# EAGLE design multipointMv2 (EAGLE 6.2)
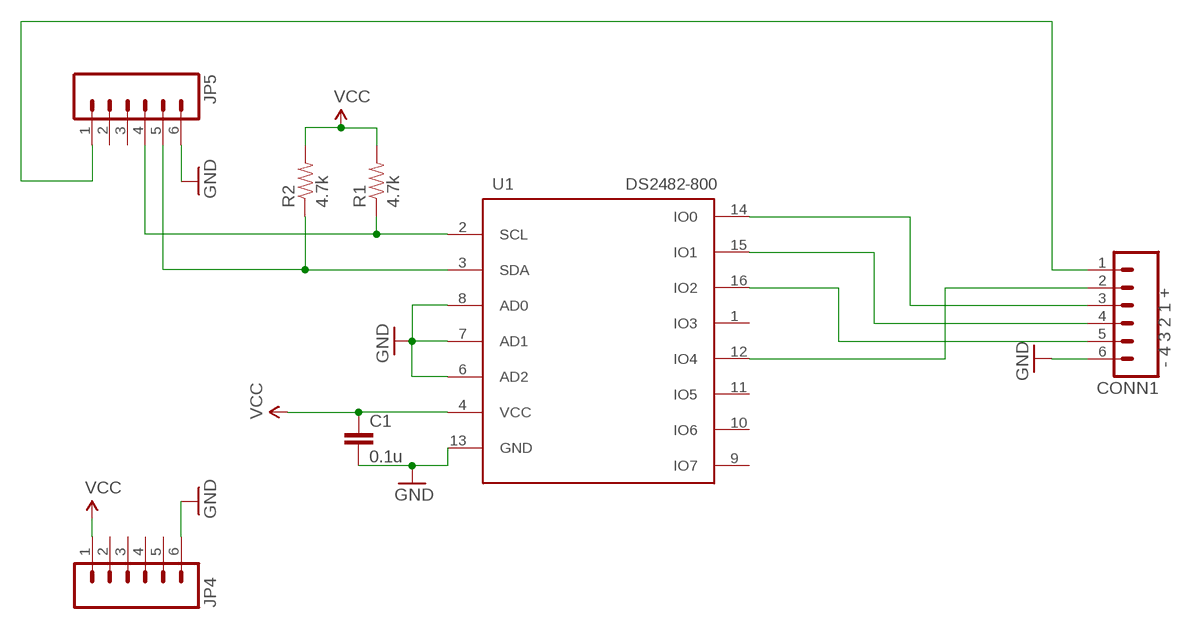
[diagram p0: schematic, sheet 1]

## Parts
C1  0.1u  CAP0805  [0805]
CONN1  - 4 3 2 1 +  M06LOCK_LONGPADS  [1X06_LOCK_LONGPADS]
JP4  M06LOCK_LONGPADS  [1X06_LOCK_LONGPADS]
JP5  M06LOCK_LONGPADS  [1X06_LOCK_LONGPADS]
R1  4.7k  RESISTOR0805-RES  [0805]
R2  4.7k  RESISTOR0805-RES  [0805]
U1  DS2482-800  [SO16]

## Nets
GND: C1.2 CONN1.6 JP4.6 JP5.6 U1.6(AD2) U1.7(AD1) U1.8(AD0) U1.13(GND)
N$1: CONN1.5 U1.16(IO2)
N$2: CONN1.4 U1.15(IO1)
N$3: CONN1.3 U1.14(IO0)
N$4: CONN1.2 U1.12(IO4)
N$7: CONN1.1 JP5.1
SCL: JP5.4 R1.1 U1.2(SCL)
SDA: JP5.5 R2.1 U1.3(SDA)
VCC: C1.1 JP4.1 R1.2 R2.2 U1.4(VCC)
Unconnected: JP4.2 JP4.3 JP4.4 JP4.5 JP5.2 JP5.3 U1.1(IO3) U1.9(IO7) U1.10(IO6) U1.11(IO5)

## Library data of the parts
C1 = SparkFun-Passives:CAP: Capacitor Standard 0603 ceramic capacitor, and 0.1" leaded capacitor.
CONN1 = SparkFun-Connectors:M06: Header 6 Standard 6-pin 0.1" header. Use with straight break away headers (SKU : PRT-00116), right angle break away headers (PRT-00553), swiss pins (PRT-00743), machine pins (PRT-00117), and female headers (PRT-00115). Molex polarized connector foot print use with SKU : PRT-08094 with associated crimp pins and housings. NOTES ON THE VARIANTS LOCK and LOCK_LONGPADS... This footprint was designed to help hold the alignment of a through-hole component (i.e. 6-pin header) while soldering it into place. You may notice that each hole has been shifted either up or down by 0.005 of an inch from it's more standard position (which is a perfectly straight line). This slight alteration caused the pins (the squares in the middle) to touch the edges of the holes. Because they are alternating, it causes a "brace" to hold the component in place. 0.005 has proven to be the perfect amount of "off-center" position when using our standard breakaway headers. Although looks a little odd when you look at the bare footprint, once you have a header in there, the alteration is very hard to notice. Also, if you push a header all the way into place, it is covered up entirely on the bottom side. This idea of altering the position of holes to aid alignment will be further integrated into the Sparkfun Library for other footprints. It can help hold any component with 3 or more connection pins.
JP4 JP5 = SparkFun:M06: Header 6 Standard 6-pin 0.1" header. Use with straight break away headers (SKU : PRT-00116), right angle break away headers (PRT-00553), swiss pins (PRT-00743), machine pins (PRT-00117), and female headers (PRT-00115). Molex polarized connector foot print use with SKU : PRT-08094 with associated crimp pins and housings. NOTES ON THE VARIANTS LOCK and LOCK_LONGPADS... This footprint was designed to help hold the alignment of a through-hole component (i.e. 6-pin header) while soldering it into place. You may notice that each hole has been shifted either up or down by 0.005 of an inch from it's more standard position (which is a perfectly straight line). This slight alteration caused the pins (the squares in the middle) to touch the edges of the holes. Because they are alternating, it causes a "brace" to hold the component in place. 0.005 has proven to be the perfect amount of "off-center" position when using our standard breakaway headers. Although looks a little odd when you look at the bare footprint, once you have a header in there, the alteration is very hard to notice. Also, if you push a header all the way into place, it is covered up entirely on the bottom side. This idea of altering the position of holes to aid alignment will be further integrated into the Sparkfun Library for other footprints. It can help hold any component with 3 or more connection pins.
R1 R2 = SparkFun-Passives:RESISTOR: Resistor Basic schematic elements and footprints for 0603, 1206, and PTH resistors.
U1 = exoteric-analytics-custom:DS2482-800

## Board
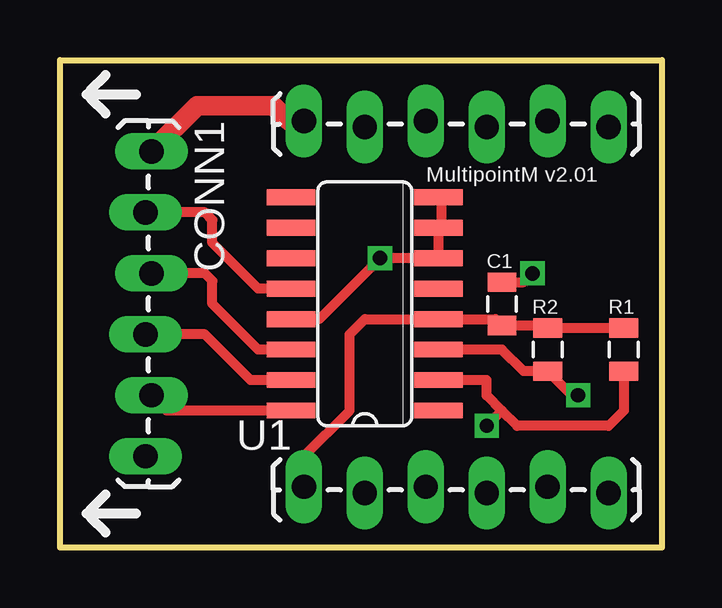
[diagram p1: board, top side]
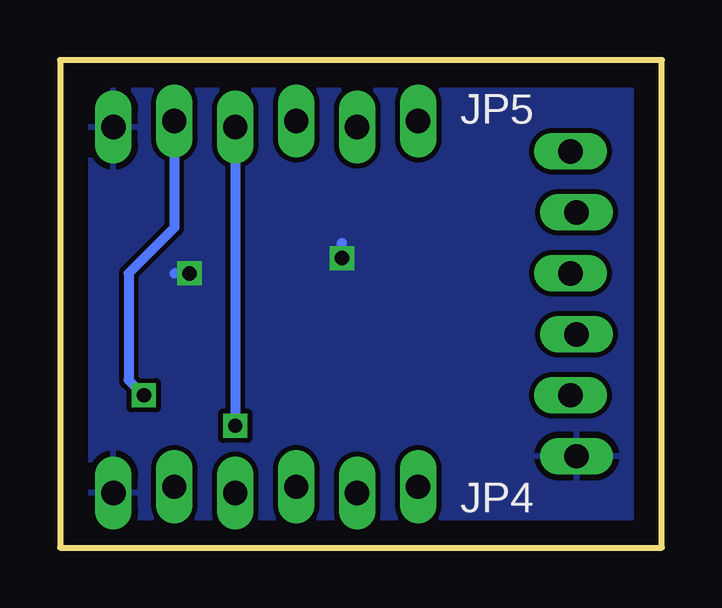
[diagram p2: board, bottom side, seen from below]

Size 25.08 x 20.32 mm. Coordinates in mm from the lower left corner, seen from the top.
Outline: 0,0 0,20.32 25.08,20.32 25.08,0 0,0
Copper layers (1*16): Top 0.035mm / dielectric 1.5mm / Bottom 0.035mm
Design rules "default": minimum track width 10mil, minimum drill 24mil, track to track 8mil, track to pad 8mil, pad to pad 8mil, via to via 8mil, smd to smd 8mil, copper to edge 40mil, drill to drill 8mil, minimum pad ring 10mil, minimum via ring 8mil, stop-mask expansion 4mil, vias tented up to drill 0mil, thermal gap 10mil

### Footprints (pad centres in the part's own frame; a part is rotated, then mirrored left to right if it is on the bottom)
0805 = smd 0.8 x 1.2: 1 -0.9,0; 2 0.9,0
1X06_LOCK_LONGPADS = drill 1.016 long: 1 0,0; 2 2.54,-0.254; 3 5.08,0; 4 7.62,-0.254; 5 10.16,0; 6 12.7,-0.254
SO16 = smd 0.66 x 2.032: 1 -4.445,-3.073; 2 -3.175,-3.073; 3 -1.905,-3.073; 4 -0.635,-3.073; 5 0.635,-3.073; 6 1.905,-3.073; 7 3.175,-3.073; 8 4.445,-3.073; 9 4.445,3.073; 10 3.175,3.073; 11 1.905,3.073; 12 0.635,3.073; 13 -0.635,3.073; 14 -1.905,3.073; 15 -3.175,3.073; 16 -4.445,3.073

### Placement (x,y rotation side)
C1  18.41,10.16 90 top
CONN1  3.81,16.51 270 top
JP4  10.16,2.54 0 top
JP5  10.16,17.78 0 top
R1  23.5,8.26 90 top
R2  20.32,8.26 90 top
U1  12.7,10.16 90 top

### Tracks (layer width: path | path; a pad name or v marks a point on that pad's centre or on a via)
GND  (via drill 0.6)
  Top 0.406: C1.2 19.32,11.06 v19.68,11.43 | U1.8 15.88,14.61 15.88,13.44 U1.7 U1.6 v13.34,12.06 10.79,9.53 U1.13
  Bottom 0.406: v19.68,11.43 20.32,11.43 | v13.34,12.06 13.34,12.7
  pour Bottom: 0.64,19.68 24.13,19.37 24.13,0.95 0.64,0.64
N$1
  Top 0.406: U1.16 4.45,5.71 CONN1.5
N$2
  Top 0.406: U1.15 7.94,6.99 6.03,8.89 CONN1.4
N$3
  Top 0.406: U1.14 8.26,8.26 6.35,10.16 6.35,11.11 6.03,11.43 CONN1.3
N$4
  Top 0.406: U1.12 8.26,10.79 6.35,12.7 6.35,13.65 6.03,13.97 CONN1.2
N$7
  Top 0.813: JP5.1 9.53,17.78 8.89,18.41 5.71,18.41 CONN1.1
SCL  (via drill 0.6)
  Top 0.406: R1.1 23.5,5.71 22.86,5.08 19.05,5.08 18.41,5.71 | 18.41,5.71 17.78,6.35 17.78,6.99 U1.2 | v17.78,5.08 18.41,5.71
  Bottom 0.406: JP5.4 v17.78,5.08
SDA  (via drill 0.6)
  Top 0.406: v21.59,6.35 21.32,6.35 R2.1 19.32,7.36 18.41,8.26 U1.3
  Bottom 0.406: JP5.5 20.32,13.34 22.23,11.43 22.23,6.99 v21.59,6.35
VCC
  Top 0.406: JP4.1 10.16,3.81 12.06,5.71 12.06,8.89 12.7,9.53 U1.4 18.15,9.53 C1.1 20.21,9.26 R2.2 R1.2

### Text on the board
tPlace: MultipointM v2.01